# EAGLE design sanguinololu (EAGLE 5.11)
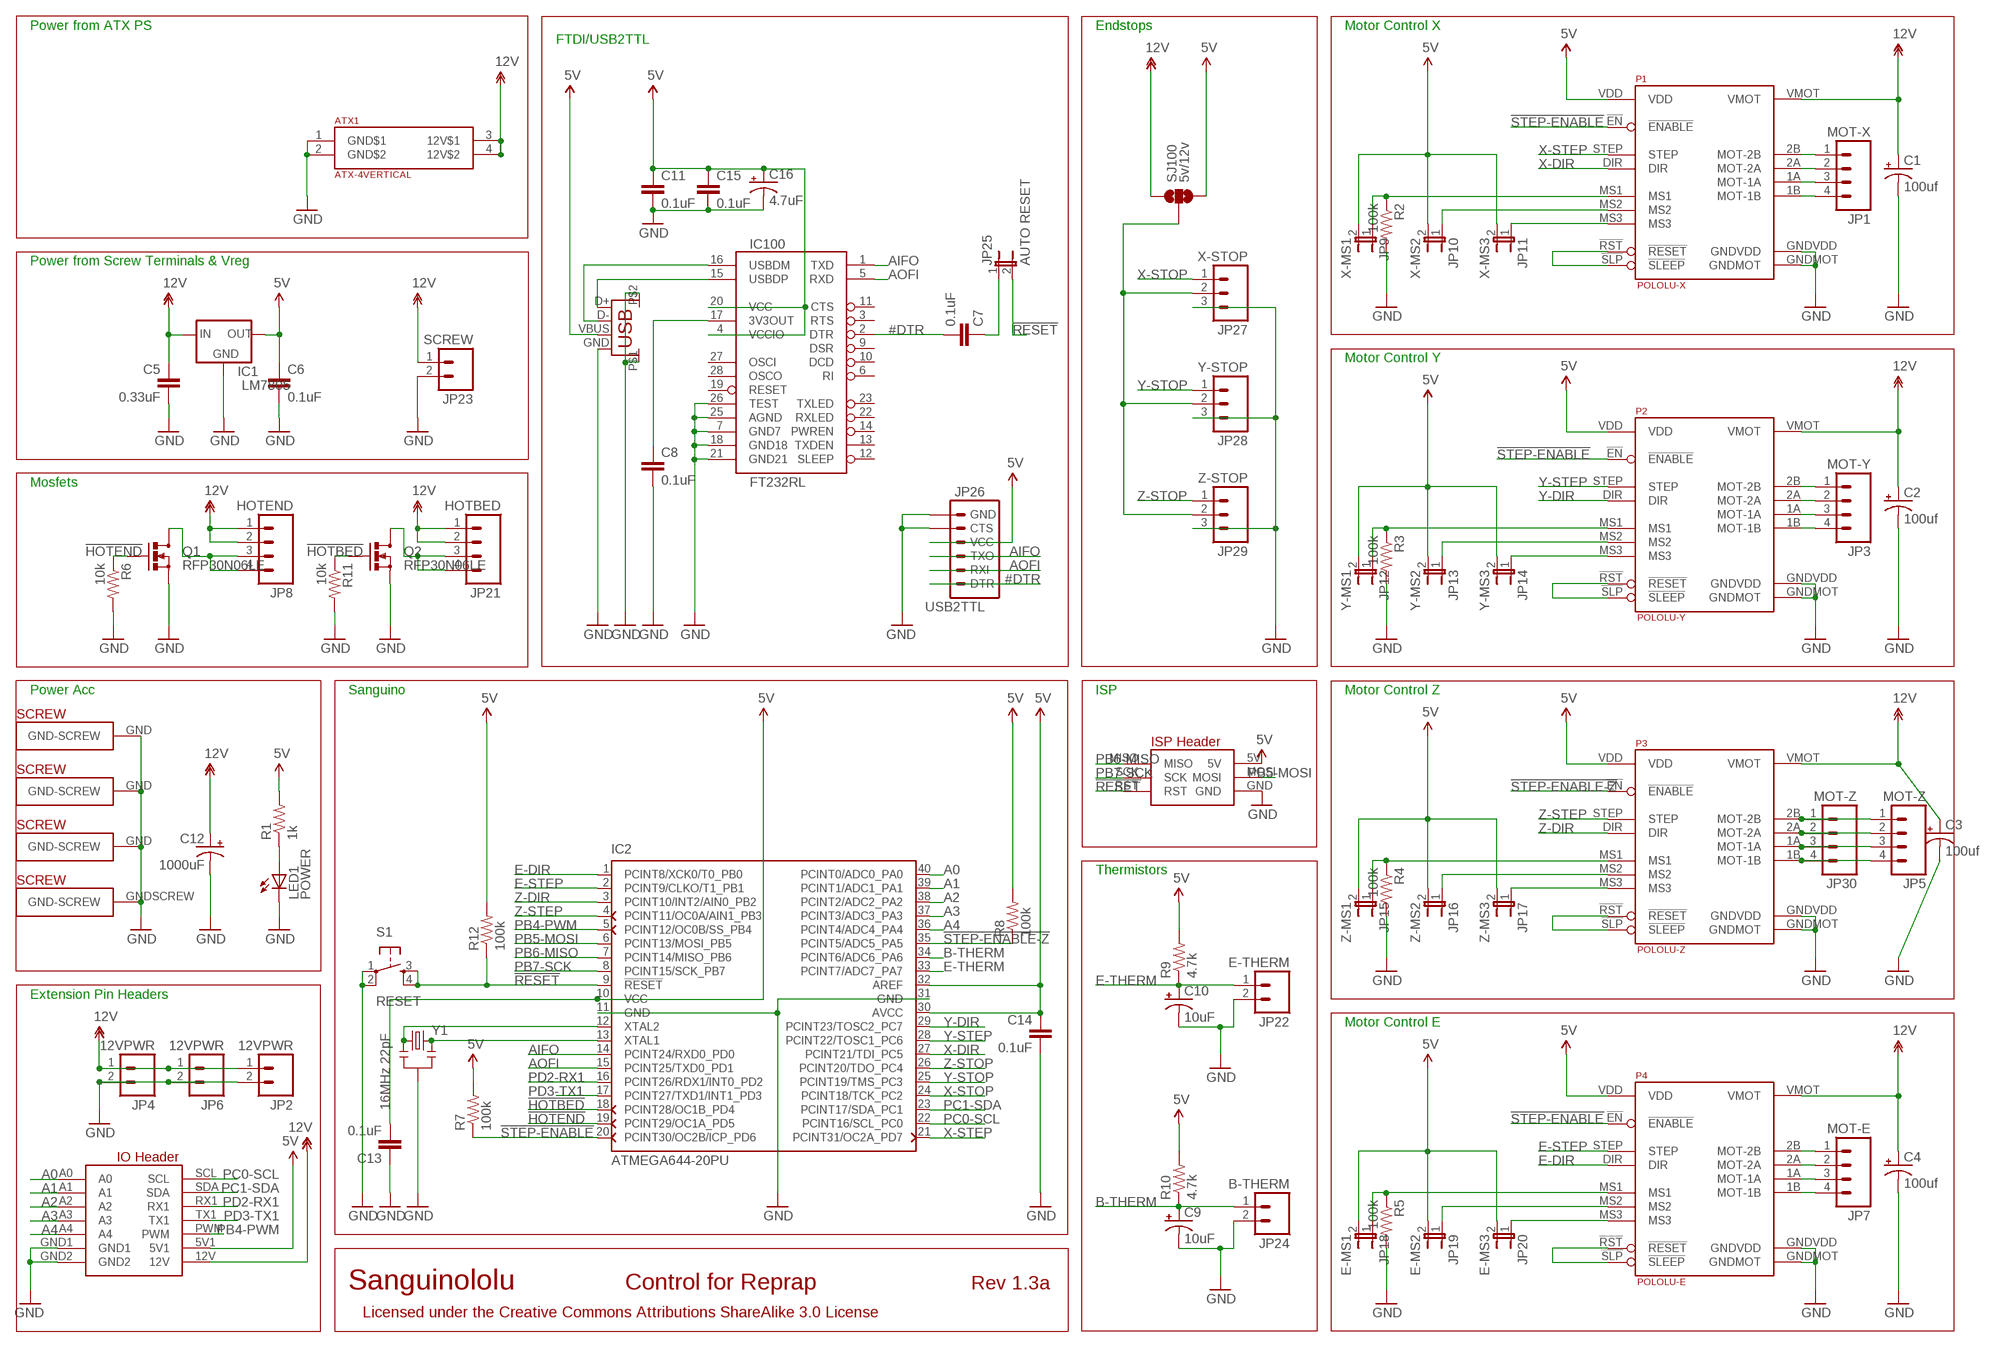
[diagram p0: schematic, sheet 1]

## Parts
ATX1  ATX-4VERTICAL  [MINIFITJR-4-VERTICAL]
C1  100uf  CAP_POLPTH1  [CPOL-RADIAL-100UF-25V]
C2  100uf  CAP_POLPTH1  [CPOL-RADIAL-100UF-25V]
C3  100uf  CAP_POLPTH1  [CPOL-RADIAL-100UF-25V]
C4  100uf  CAP_POLPTH1  [CPOL-RADIAL-100UF-25V]
C5  0.33uF  CAPPTH2  [CAP-PTH-SMALL2]
C6  0.1uF  CAPPTH2  [CAP-PTH-SMALL2]
C7  0.1uF  CAPPTH2  [CAP-PTH-SMALL2]
C8  0.1uF  CAPPTH2  [CAP-PTH-SMALL2]
C9  10uF  CAP_POLPTH2  [CPOL-RADIAL-10UF-25V]
C10  10uF  CAP_POLPTH2  [CPOL-RADIAL-10UF-25V]
C11  0.1uF  CAPPTH2  [CAP-PTH-SMALL2]
C12  1000uF  CAP_POLPTH4  [CPOL-RADIAL-1000UF-25V]
C13  0.1uF  CAPPTH2  [CAP-PTH-SMALL2]
C14  0.1uF  CAPPTH2  [CAP-PTH-SMALL2]
C15  0.1uF  CAPPTH2  [CAP-PTH-SMALL2]
C16  4.7uF  CAP_POLPTH2  [CPOL-RADIAL-10UF-25V]
IC1  LM7805  V_REG_78XX  [78XXL-CUSTOM]
IC2  ATMEGA644-20PU  [DIL40]
IC100  FT232RL  FT232RLSSOP  [SSOP28DB]
J1  USB  USBPTH  [USB-B-PTH]
JP1  MOT-X  M04POLAR  [MOLEX-1X4]
JP2  12VPWR  M02POLAR  [MOLEX-1X2]
JP3  MOT-Y  M04POLAR  [MOLEX-1X4]
JP4  12VPWR  M02POLAR  [MOLEX-1X2]
JP5  MOT-Z  M04POLAR  [MOLEX-1X4]
JP6  12VPWR  M02POLAR  [MOLEX-1X2]
JP7  MOT-E  M04POLAR  [MOLEX-1X4]
JP8  HOTEND  M04POLAR  [MOLEX-1X4]
JP9  X-MS1  JUMPER-2PTH  [1X02]
JP10  X-MS2  JUMPER-2PTH  [1X02]
JP11  X-MS3  JUMPER-2PTH  [1X02]
JP12  Y-MS1  JUMPER-2PTH  [1X02]
JP13  Y-MS2  JUMPER-2PTH  [1X02]
JP14  Y-MS3  JUMPER-2PTH  [1X02]
JP15  Z-MS1  JUMPER-2PTH  [1X02]
JP16  Z-MS2  JUMPER-2PTH  [1X02]
JP17  Z-MS3  JUMPER-2PTH  [1X02]
JP18  E-MS1  JUMPER-2PTH  [1X02]
JP19  E-MS2  JUMPER-2PTH  [1X02]
JP20  E-MS3  JUMPER-2PTH  [1X02]
JP21  HOTBED  M04POLAR  [MOLEX-1X4]
JP22  E-THERM  M02PTH  [1X02]
JP23  SCREW  M025MM  [SCREWTERMINAL-5MM-2]
JP24  B-THERM  M02PTH  [1X02]
JP25  AUTO RESET  JUMPER-2PTH  [1X02]
JP26  USB2TTL  ARDUINO_SERIAL_PROGRAMPTH  [1X06]
JP27  X-STOP  M03POLAR  [MOLEX-1X3]
JP28  Y-STOP  M03POLAR  [MOLEX-1X3]
JP29  Z-STOP  M03POLAR  [MOLEX-1X3]
JP30  MOT-Z  M04POLAR  [MOLEX-1X4]
LED1  POWER  LED3MM  [LED3MM]
P1  POLOLU-X  POLOLU-ALLEGRO  [POLOLU-ALLEGRO-PTH]
P2  POLOLU-Y  POLOLU-ALLEGRO  [POLOLU-ALLEGRO-PTH]
P3  POLOLU-Z  POLOLU-ALLEGRO  [POLOLU-ALLEGRO-PTH]
P4  POLOLU-E  POLOLU-ALLEGRO  [POLOLU-ALLEGRO-PTH]
Q1  RFP30N06LE  MOSFET-NCHANNELPTH2  [TO220V]
Q2  RFP30N06LE  MOSFET-NCHANNELPTH2  [TO220V]
R1  1k  RESISTORPTH1  [AXIAL-0.3]
R2  100k  RESISTORPTH1  [AXIAL-0.3]
R3  100k  RESISTORPTH1  [AXIAL-0.3]
R4  100k  RESISTORPTH1  [AXIAL-0.3]
R5  100k  RESISTORPTH1  [AXIAL-0.3]
R6  10k  RESISTORPTH1  [AXIAL-0.3]
R7  100k  RESISTORPTH1  [AXIAL-0.3]
R8  100k  RESISTORPTH1  [AXIAL-0.3]
R9  4.7k  RESISTORPTH1  [AXIAL-0.3]
R10  4.7k  RESISTORPTH1  [AXIAL-0.3]
R11  10k  RESISTORPTH1  [AXIAL-0.3]
R12  100k  RESISTORPTH1  [AXIAL-0.3]
S1  RESET  TAC_SWITCHPTH  [TACTILE-PTH]
SJ100  5v/12v  SOLDERJUMPER_2WAYS  [SJ_3]
U$17  PLATED-SCREW  [PLATEDSCREW]
U$24  IO_HEADERS_SCREW  [IO_HEADER-PLATEDSCREW]
U$37  PLATED-SCREW  [PLATEDSCREW]
U$38  PLATED-SCREW  [PLATEDSCREW]
Y1  16MHz 22pF  RESONATORPTH  [RESONATOR-PTH]

## Nets
3V3: C8.1 IC100.17(3V3OUT)
5V: C6.1 C11.1 C13.2 C14.1 C15.1 C16.1(+) IC1.OUT IC2.10(VCC) IC2.30(AVCC) IC2.32(AREF) IC100.4(VCCIO) IC100.20(VCC) J1.VBUS JP9.2 JP10.2 JP11.2 JP12.2 JP13.2 JP14.2 JP15.2 JP16.2 JP17.2 JP18.2 JP19.2 JP20.2 JP26.4(VCC) P1.VDD P2.VDD P3.VDD P4.VDD R1.P$2 R7.P$2 R8.P$2 R9.P$2 R10.P$2 R12.P$2 SJ100.3 U$24.5V U$24.5V1
12V: ATX1.3(12V$1) ATX1.4(12V$2) C1.1(+) C2.1(+) C3.1(+) C4.1(+) C5.1 C12.1(+) IC1.IN JP2.1 JP4.1 JP6.1 JP8.1 JP8.2 JP21.1 JP21.2 JP23.1 P1.VMOT P2.VMOT P3.VMOT P4.VMOT SJ100.1 U$24.12V
!FTDI-RESET: C7.1 JP25.1
!HOTBED: IC2.18(PCINT28/OC1B_PD4) Q2.1(G) R11.P$1
!HOTEND: IC2.19(PCINT29/OC1A_PD5) Q1.1(G) R6.P$1
!RESET: IC2.9(!RESET) JP25.2 R12.P$1 S1.3 S1.4 U$24.RST
!STEP-ENABLE: IC2.20(PCINT30/OC2B/ICP_PD6) P1.!EN(!ENABLE) P2.!EN(!ENABLE) P4.!EN(!ENABLE) R7.P$1
!STEP-ENABLE-Z: IC2.35(PCINT5/ADC5_PA5) P3.!EN(!ENABLE) R8.P$1
#DTR: C7.2 IC100.2(DTR) JP26.1(DTR)
A0: IC2.40(PCINT0/ADC0_PA0) U$24.A0
A1: IC2.39(PCINT1/ADC1_PA1) U$24.A1
A2: IC2.38(PCINT2/ADC2_PA2) U$24.A2
A3: IC2.37(PCINT3/ADC3_PA3) U$24.A3
A4: IC2.36(PCINT4/ADC4_PA4) U$24.A4
AIFO: IC2.14(PCINT24/RXD0_PD0) IC100.1(TXD) JP26.3(TXO)
AOFI: IC2.15(PCINT25/TXD0_PD1) IC100.5(RXD) JP26.2(RXI)
B-THERM: C9.1(+) IC2.34(PCINT6/ADC6_PA6) JP24.1 R10.P$1
E-DIR: IC2.1(PCINT8/XCK0/T0_PB0) P4.DIR
E-MOT-1A [power]: JP7.3 P4.1A(MOT-1A)
E-MOT-1B [power]: JP7.4 P4.1B(MOT-1B)
E-MOT-2A [power]: JP7.2 P4.2A(MOT-2A)
E-MOT-2B [power]: JP7.1 P4.2B(MOT-2B)
E-MS1: JP18.1 P4.MS1 R5.P$1
E-MS2: JP19.1 P4.MS2
E-MS3: JP20.1 P4.MS3
E-RESETSLEEP: P4.!RST(!RESET) P4.!SLP(!SLEEP)
E-STEP: IC2.2(PCINT9/CLKO/T1_PB1) P4.STEP
E-THERM: C10.1(+) IC2.33(PCINT7/ADC7_PA7) JP22.1 R9.P$1
ENDSTOP+V: JP27.2 JP28.2 JP29.2 SJ100.2
GND [power]: ATX1.1(GND$1) ATX1.2(GND$2) C1.2(-) C2.2(-) C3.2(-) C4.2(-) C5.2 C6.2 C8.2 C9.2(-) C10.2(-) C11.2 C12.2(-) C13.1 C14.2 C15.2 C16.2(-) IC1.GND IC2.11(GND) IC2.31(GND) IC100.7(GND7) IC100.18(GND18) IC100.21(GND21) IC100.25(AGND) IC100.26(TEST) J1.GND J1.P$1 J1.P$2 JP2.2 JP4.2 JP6.2 JP22.2 JP23.2 JP24.2 JP26.5(CTS) JP26.6(GND) JP27.3 JP28.3 JP29.3 LED1.K(C) P1.GNDMOT P1.GNDVDD P2.GNDMOT P2.GNDVDD P3.GNDMOT P3.GNDVDD P4.GNDMOT P4.GNDVDD Q1.3(S) Q2.3(S) R2.P$2 R3.P$2 R4.P$2 R5.P$2 R6.P$2 R11.P$2 S1.1 S1.2 U$17.GND(GND-SCREW) U$24.GND U$24.GND1 U$24.GND2 U$24.GNDSCREW(GND-SCREW) U$37.GND(GND-SCREW) U$38.GND(GND-SCREW) Y1.2
HOTBED-GND [power]: JP21.3 JP21.4 Q2.2(D)
HOTEND-GND [power]: JP8.3 JP8.4 Q1.2(D)
LED1: LED1.A R1.P$1
PB4-PWM: IC2.5(PCINT12/OC0B/SS_PB4) U$24.PWM
PB5-MOSI: IC2.6(PCINT13/MOSI_PB5) U$24.MOSI
PB6-MISO: IC2.7(PCINT14/MISO_PB6) U$24.MISO
PB7-SCK: IC2.8(PCINT15/SCK_PB7) U$24.SCK
PC0-SCL: IC2.22(PCINT16/SCL_PC0) U$24.SCL
PC1-SDA: IC2.23(PCINT17/SDA_PC1) U$24.SDA
PD2-RX1: IC2.16(PCINT26/RDX1/INT0_PD2) U$24.RX1
PD3-TX1: IC2.17(PCINT27/TXD1/INT1_PD3) U$24.TX1
USBDM: IC100.16(USBDM) J1.D-
USBDP: IC100.15(USBDP) J1.D+
X-DIR: IC2.27(PCINT21/TDI_PC5) P1.DIR
X-MOT-1A [power]: JP1.3 P1.1A(MOT-1A)
X-MOT-1B [power]: JP1.4 P1.1B(MOT-1B)
X-MOT-2A [power]: JP1.2 P1.2A(MOT-2A)
X-MOT-2B [power]: JP1.1 P1.2B(MOT-2B)
X-MS1: JP9.1 P1.MS1 R2.P$1
X-MS2: JP10.1 P1.MS2
X-MS3: JP11.1 P1.MS3
X-RESETSLEEP: P1.!RST(!RESET) P1.!SLP(!SLEEP)
X-STEP: IC2.21(PCINT31/OC2A_PD7) P1.STEP
X-STOP: IC2.24(PCINT18/TCK_PC2) JP27.1
XTAL1: IC2.13(XTAL1) Y1.3
XTAL2: IC2.12(XTAL2) Y1.1
Y-DIR: IC2.29(PCINT23/TOSC2_PC7) P2.DIR
Y-MOT-1A [power]: JP3.3 P2.1A(MOT-1A)
Y-MOT-1B [power]: JP3.4 P2.1B(MOT-1B)
Y-MOT-2A [power]: JP3.2 P2.2A(MOT-2A)
Y-MOT-2B [power]: JP3.1 P2.2B(MOT-2B)
Y-MS1: JP12.1 P2.MS1 R3.P$1
Y-MS2: JP13.1 P2.MS2
Y-MS3: JP14.1 P2.MS3
Y-RESETSLEEP: P2.!RST(!RESET) P2.!SLP(!SLEEP)
Y-STEP: IC2.28(PCINT22/TOSC1_PC6) P2.STEP
Y-STOP: IC2.25(PCINT19/TMS_PC3) JP28.1
Z-DIR: IC2.3(PCINT10/INT2/AIN0_PB2) P3.DIR
Z-MOT-1A [power]: JP5.3 JP30.3 P3.1A(MOT-1A)
Z-MOT-1B [power]: JP5.4 JP30.4 P3.1B(MOT-1B)
Z-MOT-2A [power]: JP5.2 JP30.2 P3.2A(MOT-2A)
Z-MOT-2B [power]: JP5.1 JP30.1 P3.2B(MOT-2B)
Z-MS1: JP15.1 P3.MS1 R4.P$1
Z-MS2: JP16.1 P3.MS2
Z-MS3: JP17.1 P3.MS3
Z-RESETSLEEP: P3.!RST(!RESET) P3.!SLP(!SLEEP)
Z-STEP: IC2.4(PCINT11/OC0A/AIN1_PB3) P3.STEP
Z-STOP: IC2.26(PCINT20/TDO_PC4) JP29.1
Unconnected: IC100.3(RTS) IC100.6(RI) IC100.9(DSR) IC100.10(DCD) IC100.11(CTS) IC100.12(SLEEP) IC100.13(TXDEN) IC100.14(PWREN) IC100.19(RESET) IC100.22(RXLED) IC100.23(TXLED) IC100.27(OSCI) IC100.28(OSCO)

## Notes on the sheet
- Power from ATX PS | Endstops | Motor Control X
- FTDI/USB2TTL
- Power from Screw Terminals & Vreg
- Motor Control Y
- Mosfets
- Power Acc | Sanguino | ISP | Motor Control Z
- Thermistors
- Extension Pin Headers
- Motor Control E
- Sanguinololu | Control for Reprap | Rev 1.3a
- Licensed under the Creative Commons Attributions ShareAlike 3.0 License

## Library data of the parts
ATX1 = atx-power-supply:ATX-4
C1-C4 C9 C10 C12 C16 = SparkFun:CAP_POL: Capacitor Polarized These are standard SMD and PTH capacitors. Normally 10uF, 47uF, and 100uF in electrolytic and tantalum varieties. Always verify the external diameter of the through hole cap, it varies with capacity, voltage, and manufacturer. The EIA devices should be standard.
C5-C8 C11 C13-C15 = SparkFun:CAP: Capacitor Standard 0603 ceramic capacitor, and 0.1" leaded capacitor.
IC1 = SparkFun:V_REG_78XX: Voltage Regulator Standard 7805 5V regulator. IGO (Input Ground Output). Spark Fun Electronics SKU : COM-00107
IC2 = atmel:ATMEGA644-*PU: 8-bit Microcontroller with 64K Bytes In-System Programmable Flash Auto generated by make-symbol-device-package-bsdl.ulp Rev. 34 Source: http://www.atmel.com/dyn/resources/prod_documents/doc2593.pdf; MPN: ATMEGA644-20PU; OC_FARNELL: 1288340; OC_NEWARK: 23M5060
IC100 = SparkFun:FT232RL: USB UART FT232RL 4th Generation USB UART (USB <-> Serial) Controller. Spark Fun Electronics SKU : COM-00650
J1 = SparkFun:USB: USB Connectors USB-B-PTH is fully proven SKU : PRT-00139 USB-miniB is fully proven SKU : PRT-00587 USB-A-PCB is untested. USB-A-H is throughly reviewed, but untested. Spark Fun Electronics SKU : PRT-00437 USB-B-SMT is throughly reviewed, but untested. Needs silkscreen touching up. USB-A-S has not been used/tested USB-MB-H has not been used/tested
JP1 JP3 JP5 JP7 JP8 JP21 JP30 = SparkFun:M04: Header 4 Standard 4-pin 0.1" header. Use with straight break away headers (SKU : PRT-00116), right angle break away headers (PRT-00553), swiss pins (PRT-00743), machine pins (PRT-00117), and female headers (PRT-00115). Molex polarized connector foot print use with SKU : PRT-08231 with associated crimp pins and housings.
JP2 JP4 JP6 JP22-JP24 = SparkFun:M02: Header 2 Standard 2-pin 0.1" header. Use with straight break away headers (SKU : PRT-00116), right angle break away headers (PRT-00553), swiss pins (PRT-00743), machine pins (PRT-00117), and female headers (PRT-00115). Molex polarized connector foot print use with SKU : PRT-08233 with associated crimp pins and housings.
JP9-JP20 JP25 = SparkFun:JUMPER-2: Jumper Basic 0.1" spaced jumper. Use with breakaway headers.
JP26 = SparkFun:ARDUINO_SERIAL_PROGRAM
JP27-JP29 = SparkFun:M03: Header 3 Standard 3-pin 0.1" header. Use with straight break away headers (SKU : PRT-00116), right angle break away headers (PRT-00553), swiss pins (PRT-00743), machine pins (PRT-00117), and female headers (PRT-00115). Molex polarized connector foot print use with SKU : PRT-08232 with associated crimp pins and housings.
LED1 = SparkFun:LED: LEDs Standard schematic elements and footprints for 5mm, 3mm, 1206, and 0603 sized LEDs. 5mm - Spark Fun Electronics SKU : COM-00529 (and others)
P1-P4 = pololu-allegro:POLOLU-ALLEGRO
Q1 Q2 = SparkFun:MOSFET-NCHANNEL
R1-R12 = SparkFun:RESISTOR: Resistor Basic schematic elements and footprints for 0603, 1206, and PTH 1/10th watt (small) resistors.
S1 = SparkFun:TAC_SWITCH: Momentary Switch Button commonly used for reset or general input. Spark Fun Electronics SKU : COM-00097
SJ100 = SparkFun:SOLDERJUMPER_2WAY: Solder Jumper 2 way solder jumper
U$17 U$37 U$38 = Sanguinololu:PLATED-SCREW
U$24 = Sanguinololu:IO_HEADERS_SCREW
Y1 = SparkFun:RESONATOR: Resonator Small SMD resonator. This is the itty bitty 10/20MHz resonators with built in caps. CSTCE10M0G55 and CSTCE20M0V53. Footprint has been reviewed closely but hasn't been tested yet.

## Board
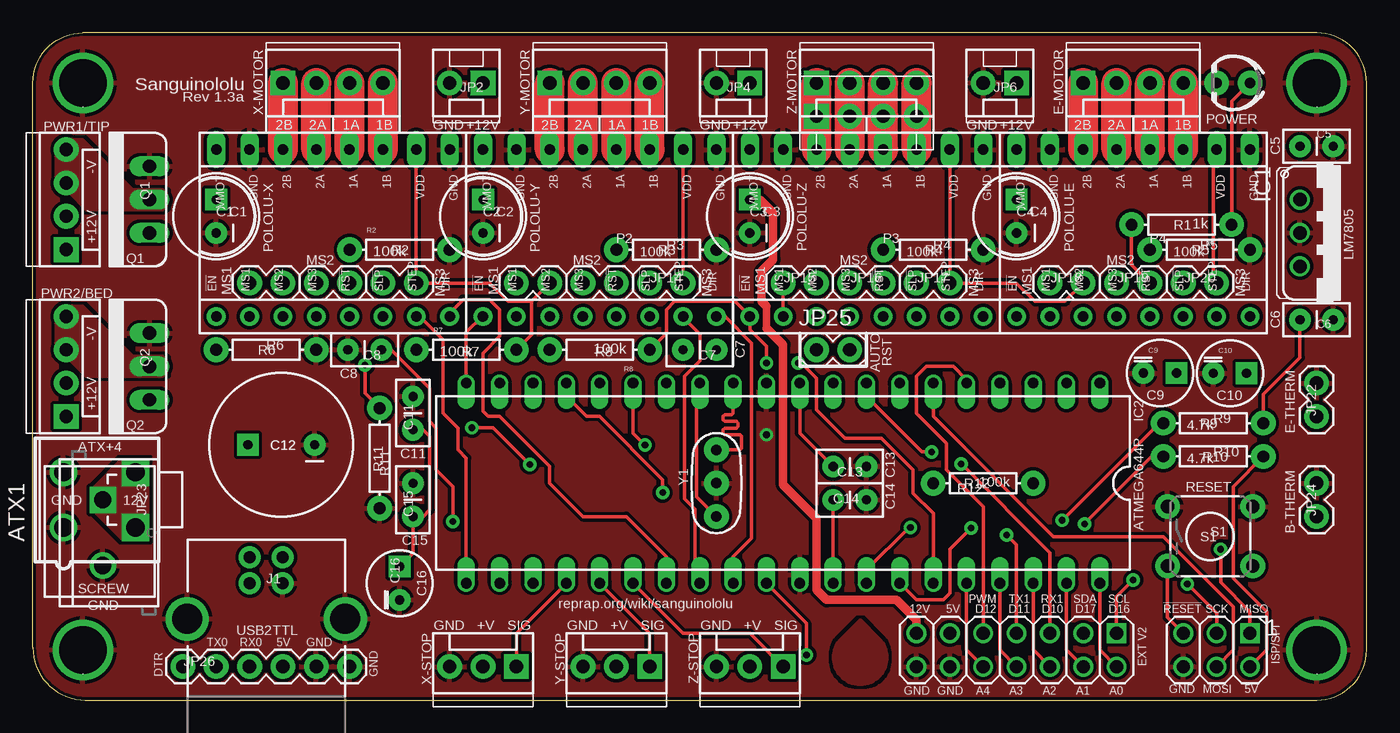
[diagram p1: board, top side]
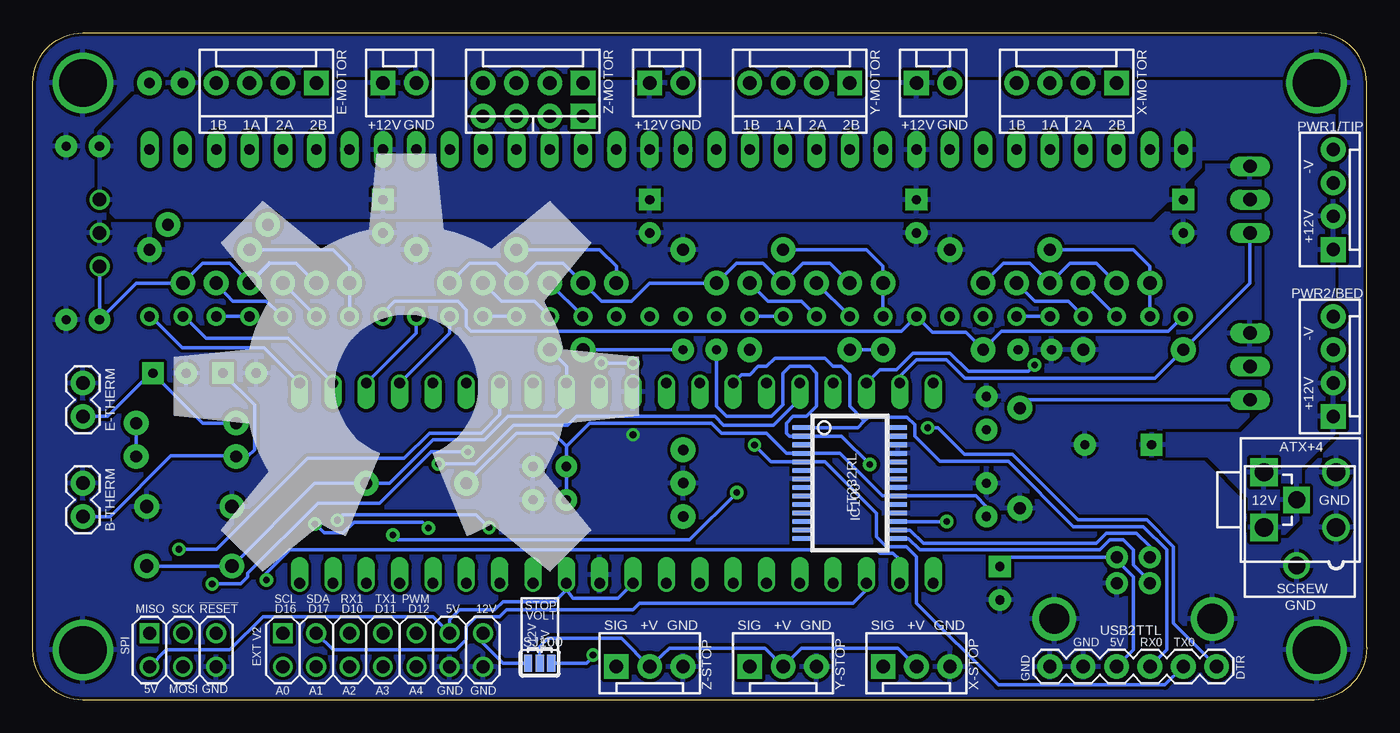
[diagram p2: board, bottom side, seen from below]

Size 101.6 x 50.8 mm. Coordinates in mm from the lower left corner, seen from the top.
Outline: 0,4 arc90 4,0 97.79,0 arc90 101.6,3.81 101.6,46.99 arc90 97.79,50.8 3.81,50.8 arc90 0,46.99 0,4
Copper layers (1*16): Top 0.035mm / dielectric 1.5mm / Bottom 0.035mm
Design rules "10width10space20drill10annular": minimum track width 10mil, minimum drill 20mil, track to track 10mil, track to pad 10mil, pad to pad 10mil, via to via 10mil, smd to smd 0mil, copper to edge 10mil, drill to drill 10mil, minimum pad ring 10mil, minimum via ring 10mil, stop-mask expansion 2mil, vias tented up to drill 25mil, thermal gap 10mil

### Footprints (pad centres in the part's own frame; a part is rotated, then mirrored left to right if it is on the bottom)
MINIFITJR-4-VERTICAL = drill 1.4 round: 1 2.1,-2.75; 2 -2.1,-2.75 | drill 1.4 square: 3 2.1,2.75; 4 -2.1,2.75
CPOL-RADIAL-100UF-25V = drill 0.7 pad 1.651 square: 1 1.27,0 | drill 0.7 pad 1.651 round: 2 -1.27,0
CAP-PTH-SMALL2 = drill 0.7 pad 1.651 round: 1 0,0; 2 2.54,0
CPOL-RADIAL-10UF-25V = drill 0.7 pad 1.651 square: 1 1.27,0 | drill 0.7 pad 1.651 round: 2 -1.27,0
CPOL-RADIAL-1000UF-25V = drill 0.7 pad 1.651 square: 1 2.54,0 | drill 0.7 pad 1.651 round: 2 -2.54,0
78XXL-CUSTOM = drill 1.016 round: GND 0,0; IN -2.54,0; OUT 2.54,0
DIL40 = drill 0.813 offset: 1 -24.13,-7.62; 2 -21.59,-7.62; 3 -19.05,-7.62; 4 -16.51,-7.62; 5 -13.97,-7.62; 6 -11.43,-7.62; 7 -8.89,-7.62; 8 -6.35,-7.62; 9 -3.81,-7.62; 10 -1.27,-7.62; 11 1.27,-7.62; 12 3.81,-7.62; 13 6.35,-7.62; 14 8.89,-7.62; 15 11.43,-7.62; 16 13.97,-7.62; 17 16.51,-7.62; 18 19.05,-7.62; 19 21.59,-7.62; 20 24.13,-7.62; 21 24.13,7.62; 22 21.59,7.62; 23 19.05,7.62; 24 16.51,7.62; 25 13.97,7.62; 26 11.43,7.62; 27 8.89,7.62; 28 6.35,7.62; 29 3.81,7.62; 30 1.27,7.62; 31 -1.27,7.62; 32 -3.81,7.62; 33 -6.35,7.62; 34 -8.89,7.62; 35 -11.43,7.62; 36 -13.97,7.62; 37 -16.51,7.62; 38 -19.05,7.62; 39 -21.59,7.62; 40 -24.13,7.62
SSOP28DB = smd 0.348 x 1.397: 1 -4.225,-3.656; 2 -3.575,-3.656; 3 -2.925,-3.656; 4 -2.275,-3.656; 5 -1.625,-3.656; 6 -0.975,-3.656; 7 -0.325,-3.656; 8 0.325,-3.656; 9 0.975,-3.656; 10 1.625,-3.656; 11 2.275,-3.656; 12 2.925,-3.656; 13 3.575,-3.656; 14 4.225,-3.656; 15 4.225,3.656; 16 3.575,3.656; 17 2.925,3.656; 18 2.275,3.656; 19 1.625,3.656; 20 0.975,3.656; 21 0.325,3.656; 22 -0.325,3.656; 23 -0.975,3.656; 24 -1.625,3.656; 25 -2.275,3.656; 26 -2.925,3.656; 27 -3.575,3.656; 28 -4.225,3.656
USB-B-PTH = drill 0.914 pad 1.676 round: D+ 0,1.25; D- 1.981,1.25; GND 0,-1.25; VBUS 1.981,-1.25 | drill 2.286 round: P$1 -2.718,-6.02; P$2 -2.718,6.02
MOLEX-1X4 = drill 1.016 pad 1.88 square: 1 0,0 | drill 1.016 pad 1.88 round: 2 2.54,0; 3 5.08,0; 4 7.62,0
MOLEX-1X2 = drill 1.016 pad 1.88 square: 1 0,0 | drill 1.016 pad 1.88 round: 2 2.54,0
1X02 = drill 1.016 pad 1.88 round: 1 0,0; 2 2.54,0
SCREWTERMINAL-5MM-2 = drill 1.3 pad 2.032 square: 1 0,0 | drill 1.3 pad 2.032 round: 2 5,0
1X06 = drill 1.016 pad 1.88 round: 1 0,0; 2 2.54,0; 3 5.08,0; 4 7.62,0; 5 10.16,0; 6 12.7,0
MOLEX-1X3 = drill 1.016 pad 1.88 square: 1 0,0 | drill 1.016 pad 1.88 round: 2 2.54,0; 3 5.08,0
LED3MM = drill 0.813 pad 1.88 round: A -1.27,0; K 1.27,0
POLOLU-ALLEGRO-PTH = drill 0.8 pad 1.422 long: 1A 6.35,-1.27; 1B 6.35,-3.81; 2A 6.35,1.27; 2B 6.35,3.81; GNDMOT 6.35,6.35; GNDVDD 6.35,-8.89; VDD 6.35,-6.35; VMOT 6.35,8.89 | drill 0.8 pad 1.422 round: !EN -6.35,8.89; !RST -6.35,-1.27; !SLP -6.35,-3.81; DIR -6.35,-8.89; MS1 -6.35,6.35; MS2 -6.35,3.81; MS3 -6.35,1.27; STEP -6.35,-6.35
TO220V = drill 1.016 long: 1 -2.54,0; 2 0,0; 3 2.54,0
AXIAL-0.3 = drill 0.9 pad 1.88 round: P$1 -3.81,0; P$2 3.81,0
TACTILE-PTH = drill 1.016 pad 1.88 round: 1 -3.251,2.261; 2 3.251,2.261; 3 -3.251,-2.261; 4 3.251,-2.261
SJ_3 = smd 0.635 x 1.27: 1 -0.889,0; 2 0,0; 3 0.889,0
PLATEDSCREW = drill 3.6 round: GND 0,0
IO_HEADER-PLATEDSCREW = drill 1 round: 5V -5.08,-1.27; 5V1 -27.94,1.27; 12V -30.48,1.27; A0 -15.24,-1.27; A1 -17.78,-1.27; A2 -20.32,-1.27; A3 -22.86,-1.27; A4 -25.4,-1.27; GND -10.16,-1.27; GND1 -27.94,-1.27; GND2 -30.48,-1.27; MOSI -7.62,-1.27; PWM -25.4,1.27; RST -10.16,1.27; RX1 -20.32,1.27; SCK -7.62,1.27; SDA -17.78,1.27; TX1 -22.86,1.27 | drill 3.6 round: GNDSCREW 0,0 | drill 1 square: MISO -5.08,1.27; SCL -15.24,1.27
RESONATOR-PTH = drill 0.8 pad 1.88 round: 1 -2.54,0; 2 0,0; 3 2.54,0

### Placement (x,y rotation side)
ATX1  5.08,15.24 270 top
C1  13.97,36.83 90 top
C2  34.29,36.83 90 top
C3  54.61,36.83 90 top
C4  74.93,36.83 90 top
C5  96.52,42.16 0 top
C6  96.52,28.96 0 top
C7  52.07,26.67 180 top
C8  26.54,26.67 180 top
C9  85.85,24.89 0 top
C10  91.19,24.88 0 top
C11  28.96,20.57 90 top
C12  18.92,19.43 180 top
C13  63.5,17.78 180 top
C14  60.96,15.24 0 top
C15  28.96,13.97 90 top
C16  27.94,8.89 90 top
IC1  96.52,35.56 270 top
IC2  57.15,16.51 180 top
IC100  39.37,16.51 270 bottom
J1  17.78,8.89 90 top
JP1  19.05,46.99 0 top
JP2  34.29,46.99 180 top
JP3  39.37,46.99 0 top
JP4  54.61,46.99 180 top
JP5  59.69,46.99 0 top
JP6  74.93,46.99 180 top
JP7  80.01,46.99 0 top
JP8  2.54,34.29 90 top
JP9  16.51,31.75 0 top
JP10  21.59,31.75 0 top
JP11  26.67,31.75 0 top
JP12  36.83,31.75 0 top
JP13  41.91,31.75 0 top
JP14  46.99,31.75 0 top
JP15  57.15,31.75 0 top
JP16  62.23,31.75 0 top
JP17  67.31,31.75 0 top
JP18  77.47,31.75 0 top
JP19  82.55,31.75 0 top
JP20  87.63,31.75 0 top
JP21  2.54,21.59 90 top
JP22  97.79,21.59 90 top
JP23  5.33,15.24 270 top
JP24  97.79,13.97 90 top
JP25  59.69,26.67 0 top
JP26  11.43,2.54 0 top
JP27  36.83,2.54 180 top
JP28  46.99,2.54 180 top
JP29  57.15,2.54 180 top
JP30  59.69,44.45 0 top
LED1  91.44,46.99 180 top
P1  22.86,35.56 90 top
P2  43.18,35.56 90 top
P3  63.5,35.56 90 top
P4  83.82,35.56 90 top
Q1  8.89,38.1 90 top
Q2  8.89,25.4 90 top
R1  87.5,36.2 180 top
R2  27.94,34.29 0 top
R3  48.26,34.29 0 top
R4  68.58,34.29 0 top
R5  88.9,34.29 0 top
R6  17.78,26.67 0 top
R7  33.02,26.67 0 top
R8  43.18,26.67 180 top
R9  89.92,21.08 0 top
R10  89.92,18.54 0 top
R11  26.42,18.41 270 top
R12  72.39,16.51 180 top
S1  89.68,12.46 0 top
SJ100  62.99,2.79 0 bottom
U$17  3.81,3.81 0 top
U$24  97.79,3.81 0 top
U$37  3.81,46.99 0 top
U$38  97.79,46.99 0 top
Y1  52.07,16.51 270 top

### Tracks (layer width: path | path; a pad name or v marks a point on that pad's centre or on a via)
3V3  (via drill 0.51 pad 1.02)
  Top 0.254: v32,13.59 32,16.26 30.73,17.53 30.73,20.7 30.23,21.21 30.23,23.75 27.3,26.67 C8.1
  Bottom 0.254: v32,13.59 IC100.17
5V  (via drill 0.51 pad 1.02)
  Top 0.254: C14.1 IC2.32 | IC2.10 58.42,20.32 C13.2 | v58.93,3.43 58.93,5.84 IC2.30 | C16.1 28.96,11.18 C15.1 29.72,13.97 30.23,14.48 30.23,20.07 29.72,20.57 C11.1 | P1.VDD JP11.2 34.8,31.75 36.2,30.35 37.97,30.35 | JP14.2 P2.VDD | P3.VDD JP17.2 74.93,31.75 76.33,30.35 78.61,30.35 JP18.2 | JP12.2 37.97,30.35 | R1.P$2 83.69,33.15 JP19.2 | JP20.2 89.92,32 89.92,41.66 P4.VDD | R9.P$2 93.73,23.27 96.52,26.06 C6.1 | U$24.5V 93.98,3.81 93.98,6.73 91.44,9.27 91.44,16.26 R10.P$2 | R7.P$2 37.97,27.81 37.97,30.35
  Bottom 0.254: IC100.20 35.71,15.49 | 60.96,8.38 60.45,7.75 57.02,7.75 IC2.30 | IC2.32 60.96,8.38 | IC100.20 36.87,15.54 40.12,18.79 IC100.4 44.19,18.79 45.72,20.32 49.15,20.32 49.91,21.08 59.18,21.08 60.96,19.3 | R12.P$2 64.77,20.32 61.98,20.32 60.96,19.3 | 60.96,19.3 C13.2 C14.1 | IC100.20 29.76,15.54 28.96,14.73 C15.1 | JP26.4 17.78,3.81 17.78,9.4 19.03,10.65 J1.VBUS 27.23,10.87 C16.1 | U$24.5V 91.44,3.81 86.61,3.81 84.07,6.35 71.12,6.35 U$24.5V1 69.85,6.1 69.09,6.86 66.42,6.86 65.79,7.49 61.85,7.49 60.96,8.38 | R10.P$2 R9.P$2 | JP9.2 20.57,33.27 22.61,33.27 JP10.2 25.65,33.27 27.69,33.27 JP11.2 | JP12.2 40.89,33.27 42.93,33.27 JP13.2 45.97,33.27 48.01,33.27 JP14.2 54.61,31.75 56.01,30.35 58.29,30.35 JP15.2 61.21,33.27 63.25,33.27 JP16.2 66.29,33.27 68.33,33.27 JP17.2 | JP18.2 81.53,33.27 83.57,33.27 | JP19.2 86.61,33.27 88.65,33.27 JP20.2 93.73,31.75 C6.1 IC1.OUT | SJ100.3 59.44,2.79 58.93,3.3 v58.93,3.43 | R7.P$2 R8.P$2
  Bottom 0.305: JP19.2 83.57,33.27
12V
  Top 0.584: 55.88,28.32 55.88,29.97
  Top 0.635: C3.1 55.37,38.1 56.39,37.08 56.39,33.53 55.5,32.64 55.5,30.35 55.88,29.97 | 55.88,28.32 57.15,27.05 57.15,16.38 59.69,13.84 59.69,8.38 60.45,7.62 65.79,7.62 67.31,6.1 U$24.12V
  Bottom 0.254: SJ100.1 65.79,2.79 67.31,4.32 U$24.12V
  pour Bottom (isolate 0.254): 2.54,20.32 2.54,44.45 5.08,46.99 92.71,46.99 96.52,43.18 96.52,38.1 95.25,36.83 16.51,36.83 15.24,38.1 13.97,38.1 13.97,39.37 12.7,40.64 12.7,41.27 7.62,41.27 7.62,22.1 9.53,20.19 17.14,20.19 17.14,18.67 12.06,18.67 8.89,15.49 8.89,12.7 6.35,12.7 5.08,13.97 5.08,17.78
  pour Top (no thermals): 4.7,16.26 6.73,18.29 8.76,18.29 8.76,12.19 6.86,12.19 4.7,14.35
!FTDI-RESET
  Bottom 0.254: C7.1 JP25.1
!HOTBED  (via drill 0.51)
  Top 0.254: v25.3,25.5 25.3,23.34 R11.P$1
  Bottom 0.254: Q2.1 25.78,22.86 R11.P$1 | v25.3,25.5 25.78,25.02 30.35,25.02 31.75,26.42 34.54,26.42 35.81,25.15 37.08,25.15 IC2.18
!HOTEND
  Bottom 0.254: IC2.19 35.56,24.64 34.29,25.91 32,25.91 30.61,24.51 16.13,24.51 R6.P$1 8.89,31.75 Q1.1
!RESET
  Top 0.254: S1.3 86.43,6.28 U$24.RST
  Bottom 0.254: S1.4 S1.3 80.12,16.51 R12.P$1 74.42,16.51 71.12,19.81 67.18,19.81 65.41,21.59 61.72,21.59 60.96,22.35 IC2.9 60.96,25.4 JP25.2
!STEP-ENABLE
  Top 0.254: IC2.20 33.02,27.99 34.24,29.21 P2.!EN
  Bottom 0.254: P4.!EN 74.93,29.46 74.04,30.35 69.22,30.35 68.58,29.72 68.58,28.45 68.2,28.07 35.43,28.07 P2.!EN 33.07,27.99 30.53,27.99 R7.P$1 27.81,28.07 15.11,28.07 P1.!EN
!STEP-ENABLE-Z  (via drill 0.51)
  Top 0.254: v55.88,25.65 55.88,26.92 54.61,28.19 P3.!EN 53.47,30.35 48.9,30.35 48.26,29.72 48.26,27.94 R8.P$1 | IC2.35 68.58,14.22 67.06,15.75 67.06,17.53 64.64,19.94 61.85,19.94 59.69,22.1 59.69,24.51 58.55,25.65 v58.29,25.65
  Bottom 0.254: v55.88,25.65 v58.29,25.65
#DTR  (via drill 0.51 pad 1.02)
  Top 0.254: v33.45,20.73 35.05,20.73 v37.85,17.93
  Bottom 0.254: IC100.2 43.03,20.12 | IC100.2 40,20.09 v37.85,17.93 | JP26.1 14.73,5.84 14.73,11.68 16.76,13.72 22,13.72 26.98,18.69 30.63,18.69 32.66,20.73 v33.45,20.73 | C7.2 49.53,22.35 48.77,21.59 45.34,21.59 44.45,22.48 44.45,24.89 43.94,25.4 42.42,25.4 41.91,24.89 41.91,22.35 42.67,21.59 43.69,21.59 44.2,21.08 44.2,20.32 43.96,20.09 IC100.2
A0
  Top 0.254: IC2.40 81.28,3.81 U$24.A0
A1
  Top 0.254: IC2.39 78.74,3.81 U$24.A1
A2
  Top 0.254: IC2.38 76.2,3.81 U$24.A2
A3
  Top 0.254: IC2.37 73.66,3.81 U$24.A3
A4
  Top 0.254: IC2.36 71.12,3.81 U$24.A4
AIFO
  Bottom 0.254: 38.32,21.17 37.95,21.54 35,21.54 34.42,20.95 34.42,20.07 32.51,18.16 27.3,18.16 22.35,13.21 17.02,13.21 15.24,11.43 15.24,3.81 JP26.3 | 38.32,21.17 38.75,20.73 IC100.1 | 38.32,21.17 38.32,21.3 39.37,22.35 39.37,24.77 40.01,25.4 40.64,25.4 41.27,26.04 45.09,26.04 45.72,25.4 46.35,25.4 46.99,24.77 47.62,24.77 IC2.14
AOFI  (via drill 0.51)
  Top 0.254: IC2.15 45.72,20.32 v46.63,19.41
  Bottom 0.254: JP26.2 15.37,1.14 28.07,1.14 34.29,7.37 34.29,10.92 35.05,11.68 36.58,11.68 37.34,12.45 37.34,14.22 41.25,18.14 IC100.5 45.36,18.14 v46.63,19.41
B-THERM  (via drill 0.51)
  Top 0.254: v80.11,13.41 85.24,18.54 R10.P$1 | IC2.34 67.31,7.62 69.34,7.62 69.85,8.13 69.85,11.48 v71.48,13.11
  Bottom 0.254: C9.1 84.71,22.48 84.71,19.05 85.22,18.54 R10.P$1 86.21,18.59 91.08,18.59 95.71,13.97 JP24.1 | v71.48,13.11 71.91,13.54 77.14,13.54 77.95,12.72 79.43,12.72 v80.11,13.41
E-DIR
  Bottom 0.254: IC2.1 83.97,26.82 90.22,26.82 92.61,29.21 P4.DIR
E-MOT-1A
  Top 2.286: P4.1A JP7.3
E-MOT-1B
  Top 2.286: P4.1B JP7.4
E-MOT-2A
  Top 2.286: P4.2A JP7.2
E-MOT-2B
  Top 2.286: P4.2B JP7.1
E-MS1
  Bottom 0.254: P4.MS1 JP18.1 77.47,33.02 78.74,34.29 R5.P$1
E-MS2
  Bottom 0.254: P4.MS2 JP19.1
E-MS3
  Bottom 0.254: P4.MS3 83.82,30.35 86.36,30.35 JP20.1
E-RESETSLEEP
  Bottom 0.254: P4.!RST P4.!SLP
E-STEP
  Bottom 0.254: IC2.2 82.14,27.53 88.39,27.53 90.07,29.21 P4.STEP
E-THERM  (via drill 0.51 pad 1.02)
  Top 0.254: v66.85,13.13 66.73,13.13 63.5,9.91 IC2.33 | v78.41,13.69 85.8,21.08 R9.P$1
  Bottom 0.254: R9.P$1 88.66,21.08 C10.1 92.56,24.94 95.91,21.59 JP22.1 | v66.85,13.13 67.82,14.1 78,14.1 v78.41,13.69
ENDSTOP+V
  Bottom 0.254: JP27.2 35.69,3.94 43.05,3.94 JP28.2 45.85,3.94 53.09,3.94 JP29.2 56.77,4.7 62.36,4.7 62.99,4.06 SJ100.2
GND  (via drill 0.51 pad 1.02)
  other vias: 55.88,20.19
  pour Top (isolate 0.254, rank 2): 3.81,-2.54 arc-90 -2.54,3.81 -2.54,46.99 arc-90 3.81,53.34 97.79,53.34 arc-90 104.14,46.99 104.14,3.81 arc-90 97.79,-2.54
  pour Bottom (isolate 0.254, rank 2): 102.87,3.81 arc-90 97.79,-1.27 3.81,-1.27 arc-90 -1.27,3.81 -1.27,46.99 arc-90 3.81,52.07 97.79,52.07 arc-90 102.87,46.99
HOTBED-GND
  pour Top (isolate 0.254, no thermals): 2.29,29.97 3.81,29.97 7.62,26.16 9.91,26.16 10.16,25.91 10.16,24.89 9.91,24.64 4.06,24.64 2.79,25.91 2.29,25.91 1.78,26.42 1.78,29.46
HOTEND-GND
  pour Top (isolate 0.254, no thermals): 2.29,42.67 3.81,42.67 7.62,38.86 9.91,38.86 10.16,38.61 10.16,37.59 9.91,37.34 4.06,37.34 2.79,38.61 2.29,38.61 1.78,39.12 1.78,42.16
LED1
  Top 0.254: R1.P$1 91.31,45.59 LED1.A
N$2
  pour Top: 63.02,6.1 61.59,4.66 arc270 64.46,4.66
PB4-PWM
  Top 0.254: U$24.PWM 72.39,14.73 69.6,17.53 69.6,19.56 67.31,21.84 67.31,24.64 68.07,25.4 70.1,25.4 71.12,24.38 IC2.5
PB5-MOSI
  Top 0.254: IC2.6 68.58,21.59 77.72,12.45 86.11,12.45 91.44,7.11 91.44,3.81 U$24.MOSI
PB6-MISO  (via drill 0.51 pad 1.02)
  Top 0.254: v90.47,11.48 90.47,8.97 92.71,6.73 U$24.MISO
  Bottom 0.254: v90.47,11.48 87.58,11.48 80.67,18.39 73.3,18.39 71.37,20.32 67.44,20.32 66.04,21.72 IC2.7
PB7-SCK  (via drill 0.51 pad 1.02)
  Top 0.254: v87.94,8.84 90.17,6.6 U$24.SCK | IC2.8 63.5,23.11 67.72,18.89 v68.45,18.89
  Bottom 0.254: v68.45,18.89 71.28,18.89 75.18,14.99 79.88,14.99 85.22,9.65 85.22,9.4 85.78,8.84 v87.94,8.84
PC0-SCL  (via drill 0.51 pad 1.02)
  Top 0.254: v83.82,9.14 82.55,7.87 U$24.SCL
  Bottom 0.254: IC2.22 35.56,10.67 36.07,11.18 37.08,11.18 37.34,11.43 82.04,11.43 83.82,9.65 v83.82,9.14
PC1-SDA
  Bottom 0.254: IC2.23 38.1,8.38 39.12,7.37 55.37,7.37 55.88,6.86 65.53,6.86 66.04,6.35 67.82,6.35 68.58,5.59 68.58,4.57 69.34,3.81 78.74,3.81 U$24.SDA
PD2-RX1  (via drill 0.51 pad 1.02)
  Top 0.254: v70.72,17.97 77.47,11.23 U$24.RX1
  Bottom 0.254: v70.72,17.97 67.93,17.97 64.97,20.93 60.86,20.93 60.2,21.59 49.66,21.59 49,20.93 45.19,20.93 43.18,22.94 IC2.16
PD3-TX1  (via drill 0.51 pad 1.02)
  Top 0.254: IC2.17 40.64,23.14 42.19,21.59 43.18,21.59 47.98,16.79 v47.98,15.8 | U$24.TX1 74.93,11.81 v74.17,12.57
  Bottom 0.254: v47.98,15.8 51.59,12.19 73.79,12.19 v74.17,12.57
USBDM
  Bottom 0.254: J1.D- 16.53,11.7 17.53,12.7 19.81,12.7 20.57,11.94 33.78,11.94 34.78,12.94 IC100.16
USBDP
  Bottom 0.254: IC100.15 34.89,12.29 34.04,11.43 20.32,11.43 19.56,12.19 18.54,12.19 17.78,11.43 17.78,10.29 16.53,9.04 J1.D+
X-DIR
  Top 0.254: IC2.27 48.26,10.92 45.21,13.97 41.91,13.97 39.37,16.51 39.37,17.78 35.56,21.59 34.67,21.59 34.29,21.97 34.29,26.42 35.56,27.69 35.56,29.72 34.8,30.48 32.77,30.48 31.75,29.46 P1.DIR
X-MOT-1A
  Top 2.286: P1.1A JP1.3
X-MOT-1B
  Top 2.286: P1.1B JP1.4
X-MOT-2A
  Top 2.286: P1.2A JP1.2
X-MOT-2B
  Top 2.286: P1.2B JP1.1
X-MS1
  Bottom 0.254: P1.MS1 JP9.1 16.51,33.02 17.78,34.29 R2.P$1
X-MS2
  Bottom 0.254: P1.MS2 JP10.1
X-MS3
  Bottom 0.254: P1.MS3 22.73,30.35 25.27,30.35 JP11.1
X-RESETSLEEP
  Bottom 0.254: P1.!RST P1.!SLP
X-STEP
  Top 0.254: P1.STEP 29.46,29.21 31.24,27.43 31.24,21.84 32.38,20.7 32.38,19.05 33.02,18.41 IC2.21
X-STOP
  Top 0.254: JP27.1 36.83,5.08 IC2.24
XTAL1
  Top 0.254: Y1.3 50.55,15.49 50.55,23.88 IC2.13
XTAL2
  Top 0.254: IC2.12 53.34,21.84 53.21,21.72 52.7,21.72 52.58,21.59 52.58,21.34 52.7,21.21 53.59,21.21 53.72,21.08 53.72,20.83 53.59,20.7 52.7,20.7 52.58,20.57 52.58,20.32 52.7,20.19 53.85,20.19 53.98,20.07 53.98,19.18 53.85,19.05 Y1.1
Y-DIR
  Top 0.254: IC2.29 53.34,10.92 54.74,12.32 54.74,27.18 52.7,29.21 P2.DIR
Y-MOT-1A
  Top 2.286: P2.1A JP3.3
Y-MOT-1B
  Top 2.286: P2.1B JP3.4
Y-MOT-2A
  Top 2.286: P2.2A JP3.2
Y-MOT-2B
  Top 2.286: P2.2B JP3.1
Y-MS1
  Bottom 0.254: P2.MS1 JP12.1 36.83,33.02 38.1,34.29 R3.P$1
Y-MS2
  Bottom 0.254: P2.MS2 JP13.1
Y-MS3
  Bottom 0.254: P2.MS3 43.05,30.35 45.59,30.35 JP14.1
Y-RESETSLEEP
  Bottom 0.254: P2.!RST P2.!SLP
Y-STEP
  Top 0.254: IC2.28 50.44,9.25 50.44,14.53 49.66,15.32 49.66,24.66 50.83,25.83 50.83,27.86 49.53,29.16 P2.STEP
Y-STOP
  Top 0.254: JP28.1 46.99,5.08 IC2.25
Z-DIR
  Bottom 0.254: IC2.3 72.39,27.94 P3.DIR
Z-MOT-1A
  Top 2.286: P3.1A JP30.3 JP5.3
Z-MOT-1B
  Top 2.286: P3.1B JP30.4 JP5.4
Z-MOT-2A
  Top 2.286: P3.2A JP30.2 JP5.2
Z-MOT-2B
  Top 2.286: P3.2B JP30.1 JP5.1
Z-MS1
  Top 0.254: P3.MS1 JP15.1
  Bottom 0.254: JP15.1 57.15,33.02 58.42,34.29 R4.P$1
Z-MS2
  Bottom 0.254: P3.MS2 JP16.1
Z-MS3
  Bottom 0.254: P3.MS3 63.37,30.35 65.91,30.35 JP17.1
Z-RESETSLEEP
  Bottom 0.254: P3.!RST P3.!SLP
Z-STEP
  Bottom 0.254: IC2.4 69.85,27.94 P3.STEP
Z-STOP
  Top 0.254: JP29.1 54.61,5.08 49.53,5.08 IC2.26

### Text on the board
_tsilk: X-MOTOR | Y-MOTOR | Z-MOTOR | E-MOTOR | Sanguinololu | Rev 1.3a | POWER | PWR1/TIP | 2B | 2A | 1A | 1B | GND | +12V | 2B | 2A | 1A | 1B | GND | +12V | GND | +12V | 2B | 2A | 1A | 1B | C5 | -V | POLOLU-X | POLOLU-Y | POLOLU-Z | POLOLU-E | +12V | C1 | C2 | C3 | C4 | R1 | MS2 | R2 | MS2 | R3 | MS2 | R4 | MS2 | R5 | LM7805 | Q1 | MS3 | MS3 | MS3 | MS3 | PWR2/BED | MS1 | MS1 | MS1 | MS1 | -V | AUTO | RST | C6 | R7 | R8 | C7 | R6 | +12V | C8 | C9 | C10 | Q2 | R9 | C12 | ATMEGA644P | E-THERM | ATX+4 | C11 | C13 | R10 | Y1 | R11 | C14 | R12 | RESET | GND | 12V | C15 | B-THERM | S1 | C16 | SCREW | reprap.org/wiki/sanguinololu | PWM | TX1 | RX1 | SDA | SCL | GND | 12V | 5V | D12 | D11 | D10 | D17 | D16 | !RESET | SCK | MISO | GND | +V | SIG | GND | +V | SIG | GND | +V | SIG | EXT V2 | ISP/SPI | USB2TTL | X-STOP | Y-STOP | Z-STOP | TX0 | RX0 | 5V | GND | DTR | GND | GND | GND | A4 | A3 | A2 | A1 | A0 | GND | MOSI | 5V
_bsilk: X-MOTOR | Y-MOTOR | Z-MOTOR | E-MOTOR | PWR1/TIP | 2B | 2A | 1A | 1B | GND | +12V | 2B | 2A | 1A | 1B | GND | +12V | GND | +12V | 2B | 2A | 1A | 1B | -V | +12V | PWR2/BED | -V | +12V | E-THERM | ATX+4 | FT232RL | B-THERM | GND | 12V | SCREW | PWM | TX1 | RX1 | SDA | SCL | GND | STOP | VOLT | 12V | 5V | D12 | D11 | D10 | D17 | D16 | !RESET | SCK | MISO | GND | +V | SIG | GND | +V | SIG | GND | +V | SIG | 12V | EXT V2 | USB2TTL | 5V | SPI | TX0 | RX0 | 5V | GND | DTR | GND | X-STOP | Y-STOP | Z-STOP | GND | GND | A4 | A3 | A2 | A1 | A0 | GND | MOSI | 5V